# Altium schematic sheet PCI_Express_Connectors.SchDoc: Apalis Evaluation Board 1.1
size A3; Organization: Toradex AG; Address1: Altsagenstrasse 5; Address2: Horw; Address3: 6048; Address4: Switzerland; DocumentNumber: 27; Revision: V1.1; SheetNumber: 27; SheetTotal: 32; PageSetup: Record=PageOptions|CenterHorizontal=True|CenterVertical=True|PrintScale=0.73|XCorrection=1.00|YCorrection=1.00|PrintKind=0|BorderSize=5000000|LeftOffset=0|BottomOffset=0|Orientation=2|PaperLength=1000|PaperWidth=1000|Scale=100|PaperSource=7|PrintQuality=-4|MediaType=1|DitherType=10|PaperKind=A4|PrintScaleMode=1
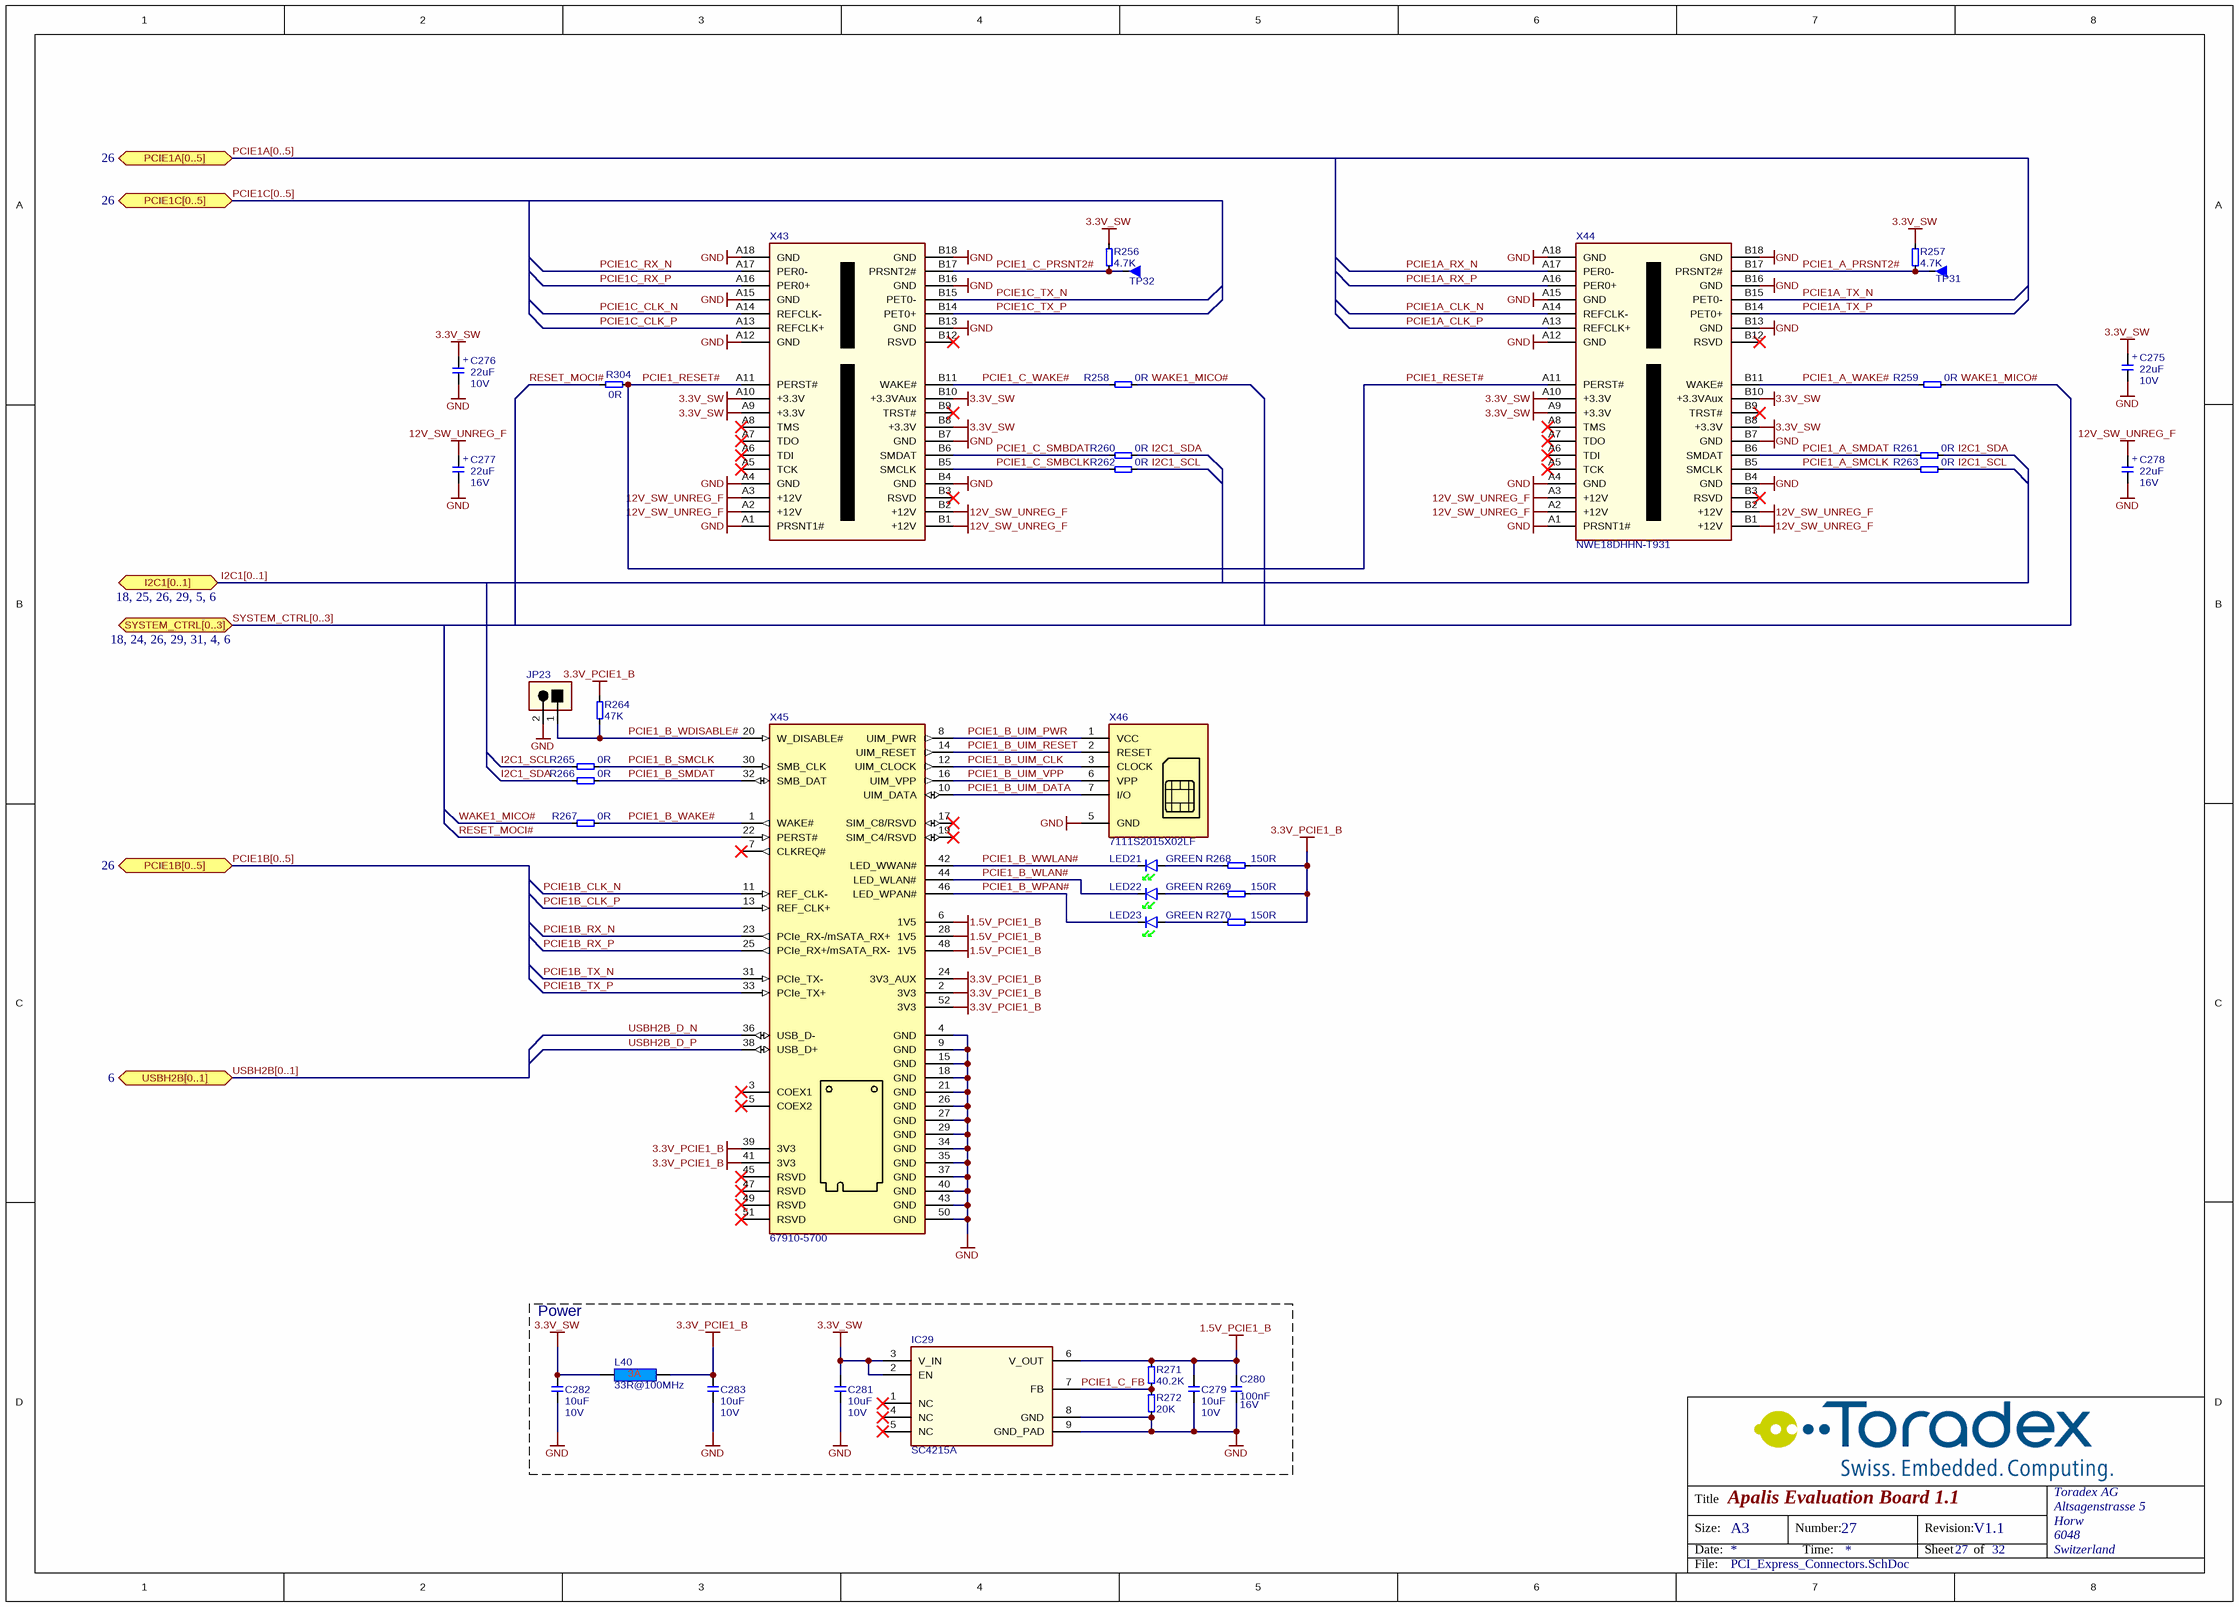
[diagram p0: PCI_Express_Connectors.SchDoc]

## Parts
C275  Rating: 10V  [CAPMP3528X210N]  (hidden comment: 22uF)
C276  Rating: 10V  [CAPMP3528X210N]  (hidden comment: 22uF)
C277  Rating: 16V  [CAPMP3528X210N]  (hidden comment: 22uF)
C278  Rating: 16V  [CAPMP3528X210N]  (hidden comment: 22uF)
C279  Rating: 10V  [T_CAPC0603X33N]  (hidden comment: 10uF)
C280  Rating: 16V  [T_CAPC0603X33N]  (hidden comment: 100nF)
C281  Rating: 10V  [T_CAPC0603X33N]  (hidden comment: 10uF)
C282  Rating: 10V  [T_CAPC0603X33N]  (hidden comment: 10uF)
C283  Rating: 10V  [T_CAPC0603X33N]  (hidden comment: 10uF)
IC29  Part No.: SC4215A  [SOIC127P650X175_HS-8N]  (hidden comment: IC-Semtech-SC4215A)
JP23  TSW-101-07-G-D  [T_Samtec_TSW-101-07-G-D]  (value not drawn)
L40  33R@100MHz  [INDC1608X95N]
LED21  Color: GREEN  [T_Osram_T670_GREEN]  (hidden comment: LG T670-K1L2-1)
LED22  Color: GREEN  [T_Osram_T670_GREEN]  (hidden comment: LG T670-K1L2-1)
LED23  Color: GREEN  [T_Osram_T670_GREEN]  (hidden comment: LG T670-K1L2-1)
R256  4.7K  [t_RESC0603X30N]
R257  4.7K  [t_RESC0603X30N]
R258  0R  [T_RESC0603X30N]
R259  0R  [T_RESC0603X30N]
R260  0R  [T_RESC0603X30N]
R261  0R  [T_RESC0603X30N]
R262  0R  [T_RESC0603X30N]
R263  0R  [T_RESC0603X30N]
R264  47K  [T_RESC0603X30N]
R265  0R  [T_RESC0603X30N]
R266  0R  [T_RESC0603X30N]
R267  0R  [T_RESC0603X30N]
R268  150R  [T_RESC0603X30N]
R269  150R  [T_RESC0603X30N]
R270  150R  [T_RESC0603X30N]
R271  40.2K  [T_RESC0603X30N]
R272  20K  [T_RESC0603X30N]
R304  0R  [T_RESC0603X30N]
TP31  Testpin  [T_TP-THT]  (value not drawn)
TP32  Testpin  [T_TP-THT]  (value not drawn)
X43  NWE18DHHN-T931  [T_Sullins_NWE18DHHN-T931]  (value not drawn)
X44  NWE18DHHN-T931  [T_Sullins_NWE18DHHN-T931]
X45  67910-5700  [T_Molex_67910-5700]
X46  7111S2015X02LF  [T_FCI_7111S2015X02LF]

## Blocks framed on the sheet
Power: C279-C283 IC29 L40 R271 R272

## Ports
I2C1[0..1] (bidir, see 18, 25, 26, 29, 5, 6), PCIE1A[0..5] (bidir, see 26), PCIE1B[0..5] (bidir, see 26), PCIE1C[0..5] (bidir, see 26), SYSTEM_CTRL[0..3] (bidir, see 18, 24, 26, 29, 31, 4, 6), USBH2B[0..1] (bidir, see 6)

## Nets
1.5V_PCIE1_B: C279.2 C280.2 IC29.6(V_OUT) R271.2 X45.6(1V5) X45.28(1V5) X45.48(1V5)
3.3V_PCIE1_B: C283.2 L40.2 R264.2 R268.2 R269.2 R270.2 X45.2(3V3) X45.24(3V3_AUX) X45.39(3V3) X45.41(3V3) X45.52(3V3)
3.3V_SW: C275.1 C276.1 C281.2 C282.2 IC29.2(EN) IC29.3(V_IN) L40.1 R256.2 R257.2 X43.A9(+3.3V) X43.A10(+3.3V) X43.B8(+3.3V) X43.B10(+3.3VAux) X44.A9(+3.3V) X44.A10(+3.3V) X44.B8(+3.3V) X44.B10(+3.3VAux)
12V_SW_UNREG_F: C277.1 C278.1 X43.A2(+12V) X43.A3(+12V) X43.B1(+12V) X43.B2(+12V) X44.A2(+12V) X44.A3(+12V) X44.B1(+12V) X44.B2(+12V)
GND: C275.2 C276.2 C277.2 C278.2 C279.1 C280.1 C281.1 C282.1 C283.1 IC29.8(GND) IC29.9(GND_PAD) JP23.2 R272.1 X43.A1(PRSNT1#) X43.A4(GND) X43.A12(GND) X43.A15(GND) X43.A18(GND) X43.B4(GND) X43.B7(GND) X43.B13(GND) X43.B16(GND) X43.B18(GND) X44.A1(PRSNT1#) X44.A4(GND) X44.A12(GND) X44.A15(GND) X44.A18(GND) X44.B4(GND) X44.B7(GND) X44.B13(GND) X44.B16(GND) X44.B18(GND) X45.4(GND) X45.9(GND) X45.15(GND) X45.18(GND) X45.21(GND) X45.26(GND) X45.27(GND) X45.29(GND) X45.34(GND) X45.35(GND) X45.37(GND) X45.40(GND) X45.43(GND) X45.50(GND) X46.5(GND)
I2C1_SCL: R262.2 R263.2 R265.1
I2C1_SDA: R260.2 R261.2 R266.1
PCIE1_A_PRSNT2#: R257.1 TP31.1 X44.B17(PRSNT2#)
PCIE1_A_SMCLK: R263.1 X44.B5(SMCLK)
PCIE1_A_SMDAT: R261.1 X44.B6(SMDAT)
PCIE1_A_WAKE#: R259.1 X44.B11(WAKE#)
PCIE1_B_SMCLK: R265.2 X45.30(SMB_CLK)
PCIE1_B_SMDAT: R266.2 X45.32(SMB_DAT)
PCIE1_B_UIM_CLK: X45.12(UIM_CLOCK) X46.3(CLOCK)
PCIE1_B_UIM_DATA: X45.10(UIM_DATA) X46.7(I/O)
PCIE1_B_UIM_PWR: X45.8(UIM_PWR) X46.1(VCC)
PCIE1_B_UIM_RESET: X45.14(UIM_RESET) X46.2(RESET)
PCIE1_B_UIM_VPP: X45.16(UIM_VPP) X46.6(VPP)
PCIE1_B_WAKE#: R267.2 X45.1(WAKE#)
PCIE1_B_WDISABLE#: JP23.1 R264.1 X45.20(W_DISABLE#)
PCIE1_B_WLAN#: LED22.K X45.44(LED_WLAN#)
PCIE1_B_WPAN#: LED23.K X45.46(LED_WPAN#)
PCIE1_B_WWLAN#: LED21.K X45.42(LED_WWAN#)
PCIE1_C_FB: IC29.7(FB) R271.1 R272.2
PCIE1_C_PRSNT2#: R256.1 TP32.1 X43.B17(PRSNT2#)
PCIE1_C_SMBCLK: R262.1 X43.B5(SMCLK)
PCIE1_C_SMBDAT: R260.1 X43.B6(SMDAT)
PCIE1_C_WAKE#: R258.1 X43.B11(WAKE#)
PCIE1_RESET#: R304.2 X43.A11(PERST#) X44.A11(PERST#)
PCIE1A_CLK_N: X44.A14(REFCLK-)
PCIE1A_CLK_P: X44.A13(REFCLK+)
PCIE1A_RX_N: X44.A17(PER0-)
PCIE1A_RX_P: X44.A16(PER0+)
PCIE1A_TX_N: X44.B15(PET0-)
PCIE1A_TX_P: X44.B14(PET0+)
PCIE1B_CLK_N: X45.11(REF_CLK-)
PCIE1B_CLK_P: X45.13(REF_CLK+)
PCIE1B_RX_N: X45.23(PCIe_RX-/mSATA_RX+)
PCIE1B_RX_P: X45.25(PCIe_RX+/mSATA_RX-)
PCIE1B_TX_N: X45.31(PCIe_TX-)
PCIE1B_TX_P: X45.33(PCIe_TX+)
PCIE1C_CLK_N: X43.A14(REFCLK-)
PCIE1C_CLK_P: X43.A13(REFCLK+)
PCIE1C_RX_N: X43.A17(PER0-)
PCIE1C_RX_P: X43.A16(PER0+)
PCIE1C_TX_N: X43.B15(PET0-)
PCIE1C_TX_P: X43.B14(PET0+)
RESET_MOCI#: R304.1 X45.22(PERST#)
USBH2B_D_N: X45.36(USB_D-)
USBH2B_D_P: X45.38(USB_D+)
WAKE1_MICO#: R258.2 R259.2 R267.1
NetLED21_A: LED21.A R268.1
NetLED22_A: LED22.A R269.1
NetLED23_A: LED23.A R270.1

Not connected (* = marked no-connect by the designer): IC29 1(NC)* 4(NC)* 5(NC)*; X43 A5(TCK)* A6(TDI)* A7(TDO)* A8(TMS)* B3(RSVD)* B9(TRST#)* B12(RSVD)*; X44 A5(TCK)* A6(TDI)* A7(TDO)* A8(TMS)* B3(RSVD)* B9(TRST#)* B12(RSVD)*; X45 3(COEX1)* 5(COEX2)* 7(CLKREQ#)* 17(SIM_C8/RSVD)* 19(SIM_C4/RSVD)* 45(RSVD)* 47(RSVD)* 49(RSVD)* 51(RSVD)*

## Buses and harness runs
bus I2C1[0..1] = port I2C1[0..1]
bus PCIE1A[0..5] = port PCIE1A[0..5]
bus PCIE1B[0..5] = port PCIE1B[0..5]
bus PCIE1C[0..5] = port PCIE1C[0..5]
bus SYSTEM_CTRL[0..3] = port SYSTEM_CTRL[0..3]
bus USBH2B[0..1] = port USBH2B[0..1]

## Notes on the sheet
- Title
- Size:
- Date:
- A3
- Number:
- Time:
- Revision:
- Sheet
- of
- File:
- (in symbol C-TA-22uF-10V-20%-3528) +
- (in symbol C-TA-22uF-16V-20%-3528) +

## Library data of the parts
C275 C276 = C-TA-22uF-10V-20%-3528: Capacitor TA 22uF 10V 20% 3528; Tolerance: 20%; Type: TA; Value: 22uF
C277 C278 = C-TA-22uF-16V-20%-3528: Capacitor TA 22uF 16V 20% 3528; Tolerance: 20%; Type: TA; Value: 22uF
C279 C281-C283 = C-X5R-10uF-10V-20%-0603: Capacitor Ceramic X5R 10uF 10V 20% 0603; Tolerance: 20%; Type: X5R; Value: 10uF
C280 = C-X7R-100nF-16V-10%-0603: Capacitor Ceramic X7R 100nF 16V 10% 0603; Tolerance: 10%; Type: X7R; Value: 100nF
IC29 = IC-Semtech-SC4215A: LDO TO 2A; Manufacturer Name: Semtech
JP23 = CON-Samtec-TSW-101-07-G-D: Header male, 1x2 Pins, 2.54 mm pitch; Manufacturer Name: Samtec; Pitch: 2.54 mm; No. of ways: 1x2; Manufacturer Part no.: TSW-101-07-G-D
L40 = L-33R@100MHz-3A-25%-0603: 33R@100MHz 3A EMI FILTER; Tolerance: 25%; Rating: 3A; Value: 33R@100MHz
LED21-LED23 = LED-Osram-T670-K1L2-1: LED green Osram LG T670-K1L2-1; Manufacturer Name: Osram; Manufacturer Part No.: LG T670-K1L2-1
R256 R257 = R-4.7kR-63mW-5%-0603: Resistor 4.7 Kohm 63mW 5% 0603; Value: 4.7KR; Rating: 63mW; Tolerance: 5%
R258-R263 R265-R267 R304 = R-0R-63mW-1%-0603: Resistor 0 ohm 63mW 1% 0603; Rating: 63mW; Tolerance: 1%; Value: 0R
R264 = R-47KR-63mW-5%-0603: Resistor 47 Kohm 63mW 5% 0603; Value: 47KR; Rating: 63mW; Tolerance: 5%
R268-R270 = R-150R-63mW-1%-0603: Resistor 150 ohm 63mW 1% 0603; Rating: 63mW; Tolerance: 1%; Value: 150R
R271 = R-40.2KR-63mW-1%-0603: Resistor 40.2 Kohm 63mW 1% 0603; Value: 40.2KR; Rating: 63mW; Tolerance: 1%
R272 = R-20KR-63mW-1%-0603: Resistor 20 Kohm 63mW 1% 0603; Value: 20KR; Rating: 63mW; Tolerance: 1%
TP31 TP32 = Testpin: Testpin TH
X43 X44 = CON-Sullins-NWE18DHHN-T931: PCI EXPRESS 36POS; No. of ways: 36; Manufacturer Name: Sullins
  X44: Manufacturer Part No.: NWE18DHHN-T931
X45 = CON-Molex-67910-5700: PCIe_Mini Card Holder; Manufacturer Name: Molex; Part No.: 67910-5700
X46 = CON-FCI-7111S2015X02LF: 6 Contacts Sim Card Holder; Manufacturer Name: FCI; Part No.: 7111S2015X02LF